# EAGLE design incubator (EAGLE 6.5.0)
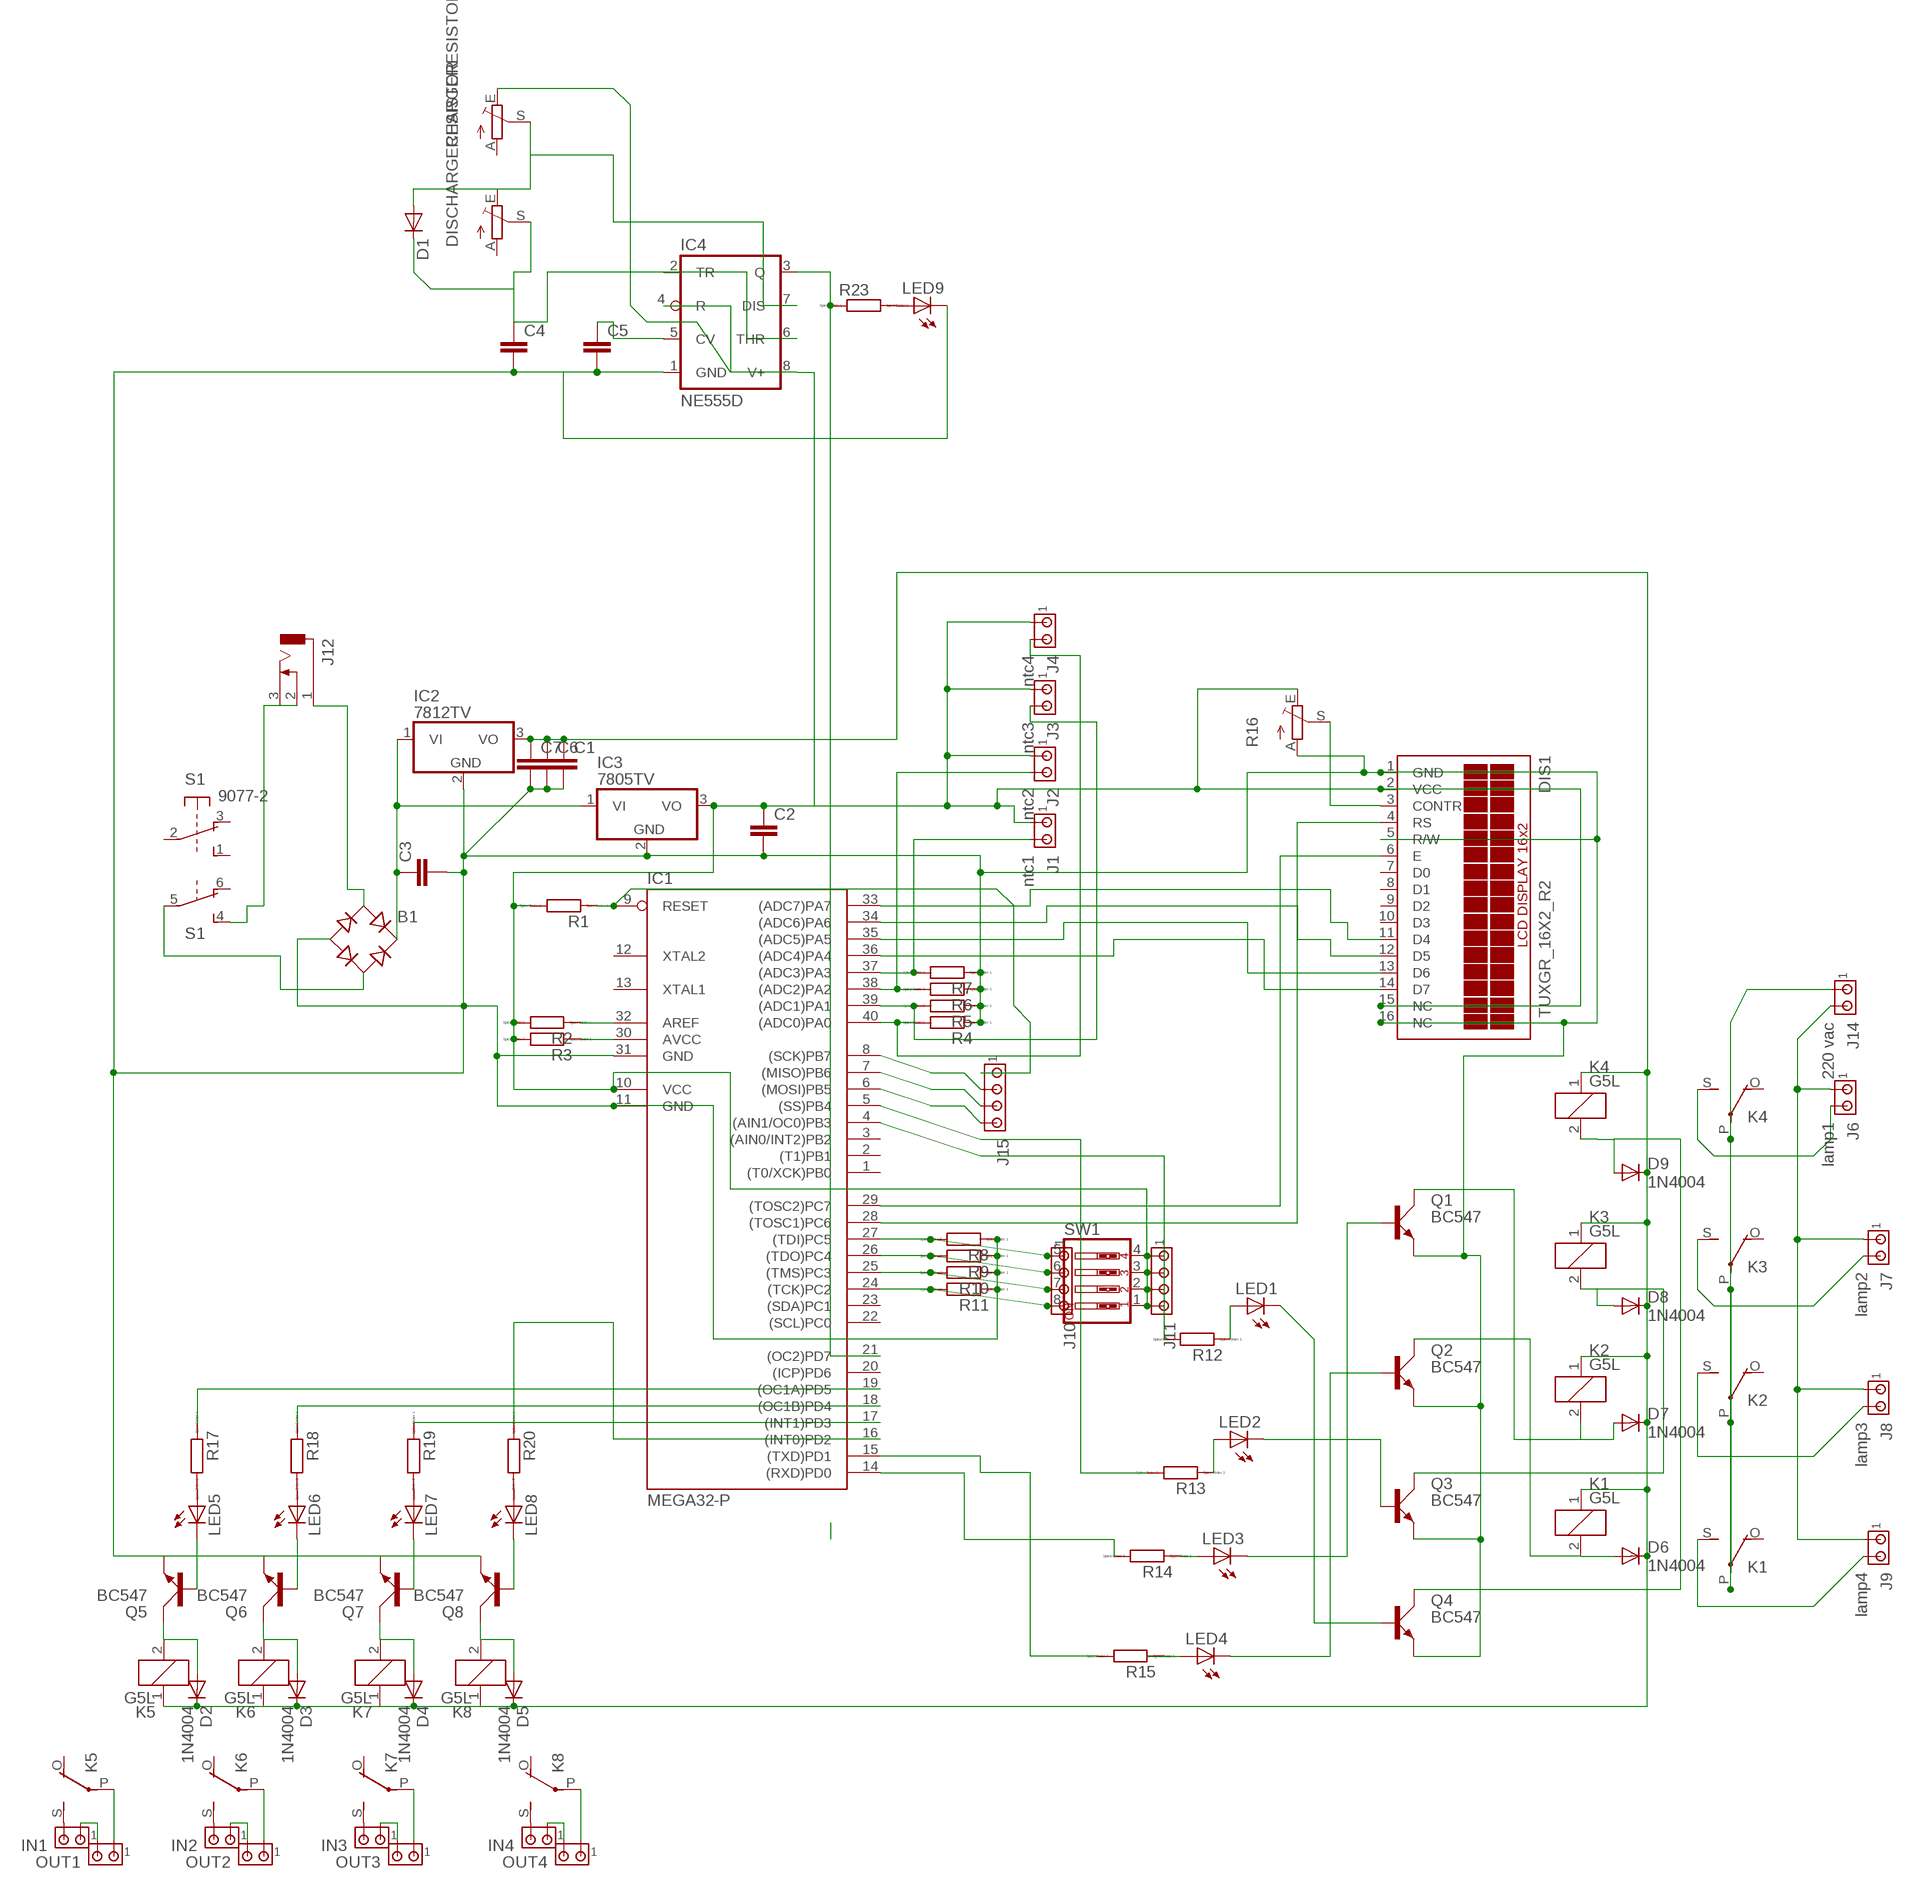
[diagram p0: schematic, sheet 1]

## Parts
B1  RB1A  [RB1A]
C1  C5/2.5  [C5B2.5]
C2  C5/2.5  [C5B2.5]
C3  C5/2.5  [C5B2.5]
C4  C5/2.5  [C5B2.5]
C5  C2,5-3  [C2.5-3]
C6  C5/2.5  [C5B2.5]
C7  C5/2.5  [C5B2.5]
CHARGERESISTOR  TRIM_EU-B64Y  [B64Y]
D1  DIODE-DO-214AC  [DO-214AC]
D2  1N4004  [DO41-10]
D3  1N4004  [DO41-10]
D4  1N4004  [DO41-10]
D5  1N4004  [DO41-10]
D6  1N4004  [DO41-10]
D7  1N4004  [DO41-10]
D8  1N4004  [DO41-10]
D9  1N4004  [DO41-10]
DIS1  TUXGR_16X2_R2  [TUXGR_16X2_R2]
DISCHARGERESISTOR  TRIM_EU-B64Y  [B64Y]
IC1  MEGA32-P  [DIL40]
IC2  7812TV  [TO220V]
IC3  7805TV  [TO220V]
IC4  NE555D  [SO08]
IN1  MTA02-156  [1X2MTA]
IN2  MTA02-156  [1X2MTA]
IN3  MTA02-156  [1X2MTA]
IN4  MTA02-156  [1X2MTA]
J1  ntc1  MTA02-156  [1X2MTA]
J2  ntc2  MTA02-156  [1X2MTA]
J3  ntc3  MTA02-156  [1X2MTA]
J4  ntc4  MTA02-156  [1X2MTA]
J6  lamp1  MTA02-156  [1X2MTA]
J7  lamp2  MTA02-156  [1X2MTA]
J8  lamp3  MTA02-156  [1X2MTA]
J9  lamp4  MTA02-156  [1X2MTA]
J10  MTA04-100  [10X04MTA]
J11  MTA04-100  [10X04MTA]
J12  DCJ0303  [DCJ0303]
J14  220 vac  MTA02-156  [1X2MTA]
J15  MTA04-100  [10X04MTA]
K1  G5L  [G5LE]
K2  G5L  [G5LE]
K3  G5L  [G5LE]
K4  G5L  [G5LE]
K5  G5L  [G5LE]
K6  G5L  [G5LE]
K7  G5L  [G5LE]
K8  G5L  [G5LE]
LED1  LED3MM  [LED3MM]
LED2  LED3MM  [LED3MM]
LED3  LED3MM  [LED3MM]
LED4  LED3MM  [LED3MM]
LED5  LED3MM  [LED3MM]
LED6  LED3MM  [LED3MM]
LED7  LED3MM  [LED3MM]
LED8  LED3MM  [LED3MM]
LED9  LED3MM  [LED3MM]
OUT1  MTA02-156  [1X2MTA]
OUT2  MTA02-156  [1X2MTA]
OUT3  MTA02-156  [1X2MTA]
OUT4  MTA02-156  [1X2MTA]
Q1  BC547  [SOT54A]
Q2  BC547  [SOT54A]
Q3  BC547  [SOT54A]
Q4  BC547  [SOT54A]
Q5  BC547  [SOT54A]
Q6  BC547  [SOT54A]
Q7  BC547  [SOT54A]
Q8  BC547  [SOT54A]
R1  RR1206  [R1206]
R2  RR1206  [R1206]
R3  RR1206  [R1206]
R4  RR1206  [R1206]
R5  RR1206  [R1206]
R6  RR1206  [R1206]
R7  RR1206  [R1206]
R8  RR1206  [R1206]
R9  RR1206  [R1206]
R10  RR1206  [R1206]
R11  RR1206  [R1206]
R12  RR1206  [R1206]
R13  RR1206  [R1206]
R14  RR1206  [R1206]
R15  RR1206  [R1206]
R16  TRIM_EU-B64Y  [B64Y]
R17  RR1206  [R1206]
R18  RR1206  [R1206]
R19  RR1206  [R1206]
R20  RR1206  [R1206]
R23  RR1206  [R1206]
S1  9077-2  [9077-2]
SW1  SW_DIP-4  [EDG-04]

## Nets
5V: C2.1 CHARGERESISTOR.E DIS1.2(VCC) DIS1.15(NC) IC1.10(VCC) IC3.3(VO) IC4.4(R) IC4.8(V+) J1.1 J2.1 J3.1 J4.1 J11.1 J11.2 J11.3 J11.4 R1.2 R2.2 R3.2 R16.E SW1.1 SW1.2 SW1.3 SW1.4
12V: C1.1 C6.1 C7.1 D2.C D3.C D4.C D5.C D6.C D7.C D8.C D9.C IC2.3(VO) K1.1 K2.1 K3.1 K4.1 K5.1 K6.1 K7.1 K8.1
AREF: IC1.32(AREF) R2.1
AVCC: IC1.30(AVCC) R3.1
D4: DIS1.11(D4) IC1.33((ADC7)PA7)
D5: DIS1.12(D5) IC1.34((ADC6)PA6)
D6: DIS1.13(D6) IC1.35((ADC5)PA5)
D7: DIS1.14(D7) IC1.36((ADC4)PA4)
ENABLE: DIS1.6(E) IC1.29((TOSC2)PC7)
GND: B1.- C1.2 C2.2 C3.2 C4.2 C5.2 C6.2 C7.2 DIS1.1(GND) DIS1.5(R/W) DIS1.16(NC) IC1.11(GND) IC1.31(GND) IC2.2(GND) IC3.2(GND) IC4.1(GND) LED9.K(C) Q1.E Q2.E Q3.E Q4.E Q5.E Q6.E Q7.E Q8.E R4.1 R5.1 R6.1 R7.1 R8.1 R9.1 R10.1 R11.1 R16.A
MISO: IC1.7((MISO)PB6) J15.3
MOSI: IC1.6((MOSI)PB5) J15.4
N$2: LED5.A R17.2
N$3: LED6.A R18.2
N$4: LED7.A R19.2
N$5: DIS1.3(CONTR) R16.S
N$6: LED8.A R20.2
N$7: LED5.K(C) Q5.B
N$8: LED6.K(C) Q6.B
N$9: LED7.K(C) Q7.B
N$10: LED8.K(C) Q8.B
N$11: J6.2 K4.S(2:S)
N$12: J7.2 K3.S(2:S)
N$13: J8.2 K2.S(2:S)
N$14: J9.2 K1.S(2:S)
N$15: IN1.2 K5.S(2:S)
N$16: J6.1 J7.1 J8.1 J9.1 J14.2
N$17: J14.1 K1.P(2:P) K2.P(2:P) K3.P(2:P) K4.P(2:P)
N$18: D2.A K5.2 Q5.C
N$19: J12.2 J12.3 S1.4(2:S)
N$20: B1.AC1 J12.1
N$21: B1.AC2 S1.5(2:P)
N$22: IC1.21((OC2)PD7) IC4.3(Q) R23.1
N$23: D3.A K6.2 Q6.C
N$24: D4.A K7.2 Q7.C
N$25: D5.A K8.2 Q8.C
N$26: IN1.1 OUT1.2
N$27: IC1.15((TXD)PD1) R15.2
N$28: IC1.14((RXD)PD0) R14.2
N$29: LED4.K(C) Q2.B
N$30: LED3.K(C) Q1.B
N$31: IC1.5((SS)PB4) R13.2
N$32: IC1.4((AIN1/OC0)PB3) R12.2
N$33: IN2.1 OUT2.2
N$34: IN3.1 OUT3.2
N$35: IN4.1 OUT4.2
N$36: LED1.K(C) Q4.B
N$37: LED2.K(C) Q3.B
N$38: D6.A K1.2 Q2.C
N$39: D7.A K2.2 Q1.C
N$40: D8.A K3.2 Q3.C
N$41: D9.A K4.2 Q4.C
N$42: IN2.2 K6.S(2:S)
N$43: IN3.2 K7.S(2:S)
N$44: IN4.2 K8.S(2:S)
N$45: K5.P(2:P) OUT1.1
N$46: K6.P(2:P) OUT2.1
N$47: K7.P(2:P) OUT3.1
N$48: K8.P(2:P) OUT4.1
N$49: IC1.16((INT0)PD2) R20.1
N$50: IC1.17((INT1)PD3) R19.1
N$51: IC1.18((OC1B)PD4) R18.1
N$52: IC1.19((OC1A)PD5) R17.1
N$53: C5.1 IC4.5(CV)
N$54: C4.1 D1.C DISCHARGERESISTOR.S IC4.2(TR) IC4.6(THR)
N$55: LED9.A R23.2
N$56: LED1.A R12.1
N$57: LED2.A R13.1
N$58: LED4.A R15.1
N$59: LED3.A R14.1
N$60: CHARGERESISTOR.S D1.A DISCHARGERESISTOR.E IC4.7(DIS)
NTC1: IC1.37((ADC3)PA3) J1.2 R7.2
NTC2: IC1.38((ADC2)PA2) J2.2 R6.2
NTC3: IC1.39((ADC1)PA1) J3.2 R5.2
NTC4: IC1.40((ADC0)PA0) J4.2 R4.2
RS: DIS1.4(RS) IC1.28((TOSC1)PC6)
RST: IC1.9(RESET) J15.1 R1.1
SCK: IC1.8((SCK)PB7) J15.2
SW1: IC1.27((TDI)PC5) J10.1 R8.2 SW1.5
SW2: IC1.26((TDO)PC4) J10.2 R9.2 SW1.6
SW3: IC1.25((TMS)PC3) J10.3 R10.2 SW1.7
SW4: IC1.24((TCK)PC2) J10.4 R11.2 SW1.8
VIN: B1.+ C3.1 IC2.1(VI) IC3.1(VI)
Unconnected: CHARGERESISTOR.A DIS1.7(D0) DIS1.8(D1) DIS1.9(D2) DIS1.10(D3) DISCHARGERESISTOR.A IC1.1((T0/XCK)PB0) IC1.2((T1)PB1) IC1.3((AIN0/INT2)PB2) IC1.12(XTAL2) IC1.13(XTAL1) IC1.20((ICP)PD6) IC1.22((SCL)PC0) IC1.23((SDA)PC1) K1.O(2:O) K2.O(2:O) K3.O(2:O) K4.O(2:O) K5.O(2:O) K6.O(2:O) K7.O(2:O) K8.O(2:O) S1.1(1:S) S1.2(1:P) S1.3(1:O) S1.6(2:O)

## Library data of the parts
B1 = rectifier:RB1A: RECTIFIER 1 A
C1-C7 = capacitor-wima:C: CAPACITOR naming: grid - package width
CHARGERESISTOR DISCHARGERESISTOR R16 = pot:TRIM_EU-: POTENTIOMETER
D1 = diode:DIODE-: DIODE
D2-D9 = diode:1N4004: DIODE general purpose rectifier, 1 A
DIS1 = display-lcd:TUXGR_16X2_R2: Tuxgraphics LCD display 16x2 characters reflective, without background light Source: tuxgr_12x2_r2.pdf; OC_FARNELL: unknown; OC_NEWARK: unknown
IC1 = atmel:MEGA32-P: MICROCONTROLLER 32 Kbytes FLASH 2 Kbytes SRAM 1 Kbytes EEPROM USART 8-channel 10 bit ADC Source: www.atmel.com .. doc2503.pdf; MPN: ATMEGA32-16PU; OC_FARNELL: 1661729; OC_NEWARK: 51P1794
IC2 IC3 = linear:78*: Positive VOLTAGE REGULATOR Source: http://cache.national.com/ds/LM/LM78L05.pdf http://www.fairchildsemi.com/ds/LM/LM7805.pdf
IC4 = linear:*555: TIMER
IN1-IN4 J1-J4 J6-J9 J14 OUT1-OUT4 = con-amp:MTA02-156: AMP connector
J10 J11 J15 = con-amp:MTA04-100: AMP connector
J12 = con-jack:DCJ0303: DC POWER JACK Source: DCJ0303.pdf; OC_FARNELL: unknown; OC_NEWARK: unknown
K1-K8 = relay:G5L: RELAY 1 x switch, 10 A/120 V AC, 8 A/30 V ADC, Omron; OC_FARNELL: unknown; OC_NEWARK: unknown
LED1-LED9 = led:LED: LED OSRAM: - CHIPLED LG R971, LG N971, LY N971, LG Q971, LY Q971, LO R971, LY R971 LH N974, LH R974 LS Q976, LO Q976, LY Q976 LO Q996 - Hyper CHIPLED LW Q18S LB Q993, LB Q99A, LB R99A - SideLED LS A670, LO A670, LY A670, LG A670, LP A670 LB A673, LV A673, LT A673, LW A673 LH A674 LY A675 LS A676, LA A676, LO A676, LY A676, LW A676 LS A679, LY A679, LG A679 - Hyper Micro SIDELED® LS Y876, LA Y876, LO Y876, LY Y876 LT Y87S - SmartLED LW L88C, LW L88S LB L89C, LB L89S, LG L890 LS L89K, LO L89K, LY L89K LS L896, LA L896, LO L896, LY L896 - TOPLED LS T670, LO T670, LY T670, LG T670, LP T670 LSG T670, LSP T670, LSY T670, LOP T670, LYG T670 LG T671, LOG T671, LSG T671 LB T673, LV T673, LT T673, LW T673 LH T674 LS T676, LA T676, LO T676, LY T676, LB T676, LH T676, LSB T676, LW T676 LB T67C, LV T67C, LT T67C, LS T67K, LO T67K, LY T67K, LW E67C LS E67B, LA E67B, LO E67B, LY E67B, LB E67C, LV E67C, LT E67C LW T67C LS T679, LY T679, LG T679 LS T770, LO T770, LY T770, LG T770, LP T770 LB T773, LV T773, LT T773, LW T773 LH T774 LS E675, LA E675, LY E675, LS T675 LS T776, LA T776, LO T776, LY T776, LB T776 LHGB T686 LT T68C, LB T68C - Hyper Mini TOPLED® LB M676 - Mini TOPLED Santana® LG M470 LS M47K, LO M47K, LY M47K Source: http://www.osram.convergy.de LUXEON: - LUMILED® LXK2-PW12-R00, LXK2-PW12-S00, LXK2-PW14-U00, LXK2-PW14-V00 LXK2-PM12-R00, LXK2-PM12-S00, LXK2-PM14-U00 LXK2-PE12-Q00, LXK2-PE12-R00, LXK2-PE12-S00, LXK2-PE14-T00, LXK2-PE14-U00 LXK2-PB12-K00, LXK2-PB12-L00, LXK2-PB12-M00, LXK2-PB14-N00, LXK2-PB14-P00, LXK2-PB14-Q00 LXK2-PR12-L00, LXK2-PR12-M00, LXK2-PR14-Q00, LXK2-PR14-R00 LXK2-PD12-Q00, LXK2-PD12-R00, LXK2-PD12-S00 LXK2-PH12-R00, LXK2-PH12-S00 LXK2-PL12-P00, LXK2-PL12-Q00, LXK2-PL12-R00 Source: www.luxeon.com KINGBRIGHT: KA-3528ASYC Source: www.kingbright.com
Q1-Q8 = transistor-small-signal:BC547: NPN TRANSISTOR
R1-R15 R17-R20 R23 = eagle-ltspice:R: RESISTOR, European symbol; SPICEMODEL: NONE; SPICEPREFIX: R
S1 = switch-misc:9077-2: MARQUARDT SWITCH 9077.0200 Distributor: Buerklin <https://www.buerklin.com/default.asp?event=ShowArtikel%2812G2822%29&l=d&jump=ArtNr_12G2822>
SW1 = special:SW_DIP-4: DIP SWITCH

## Board
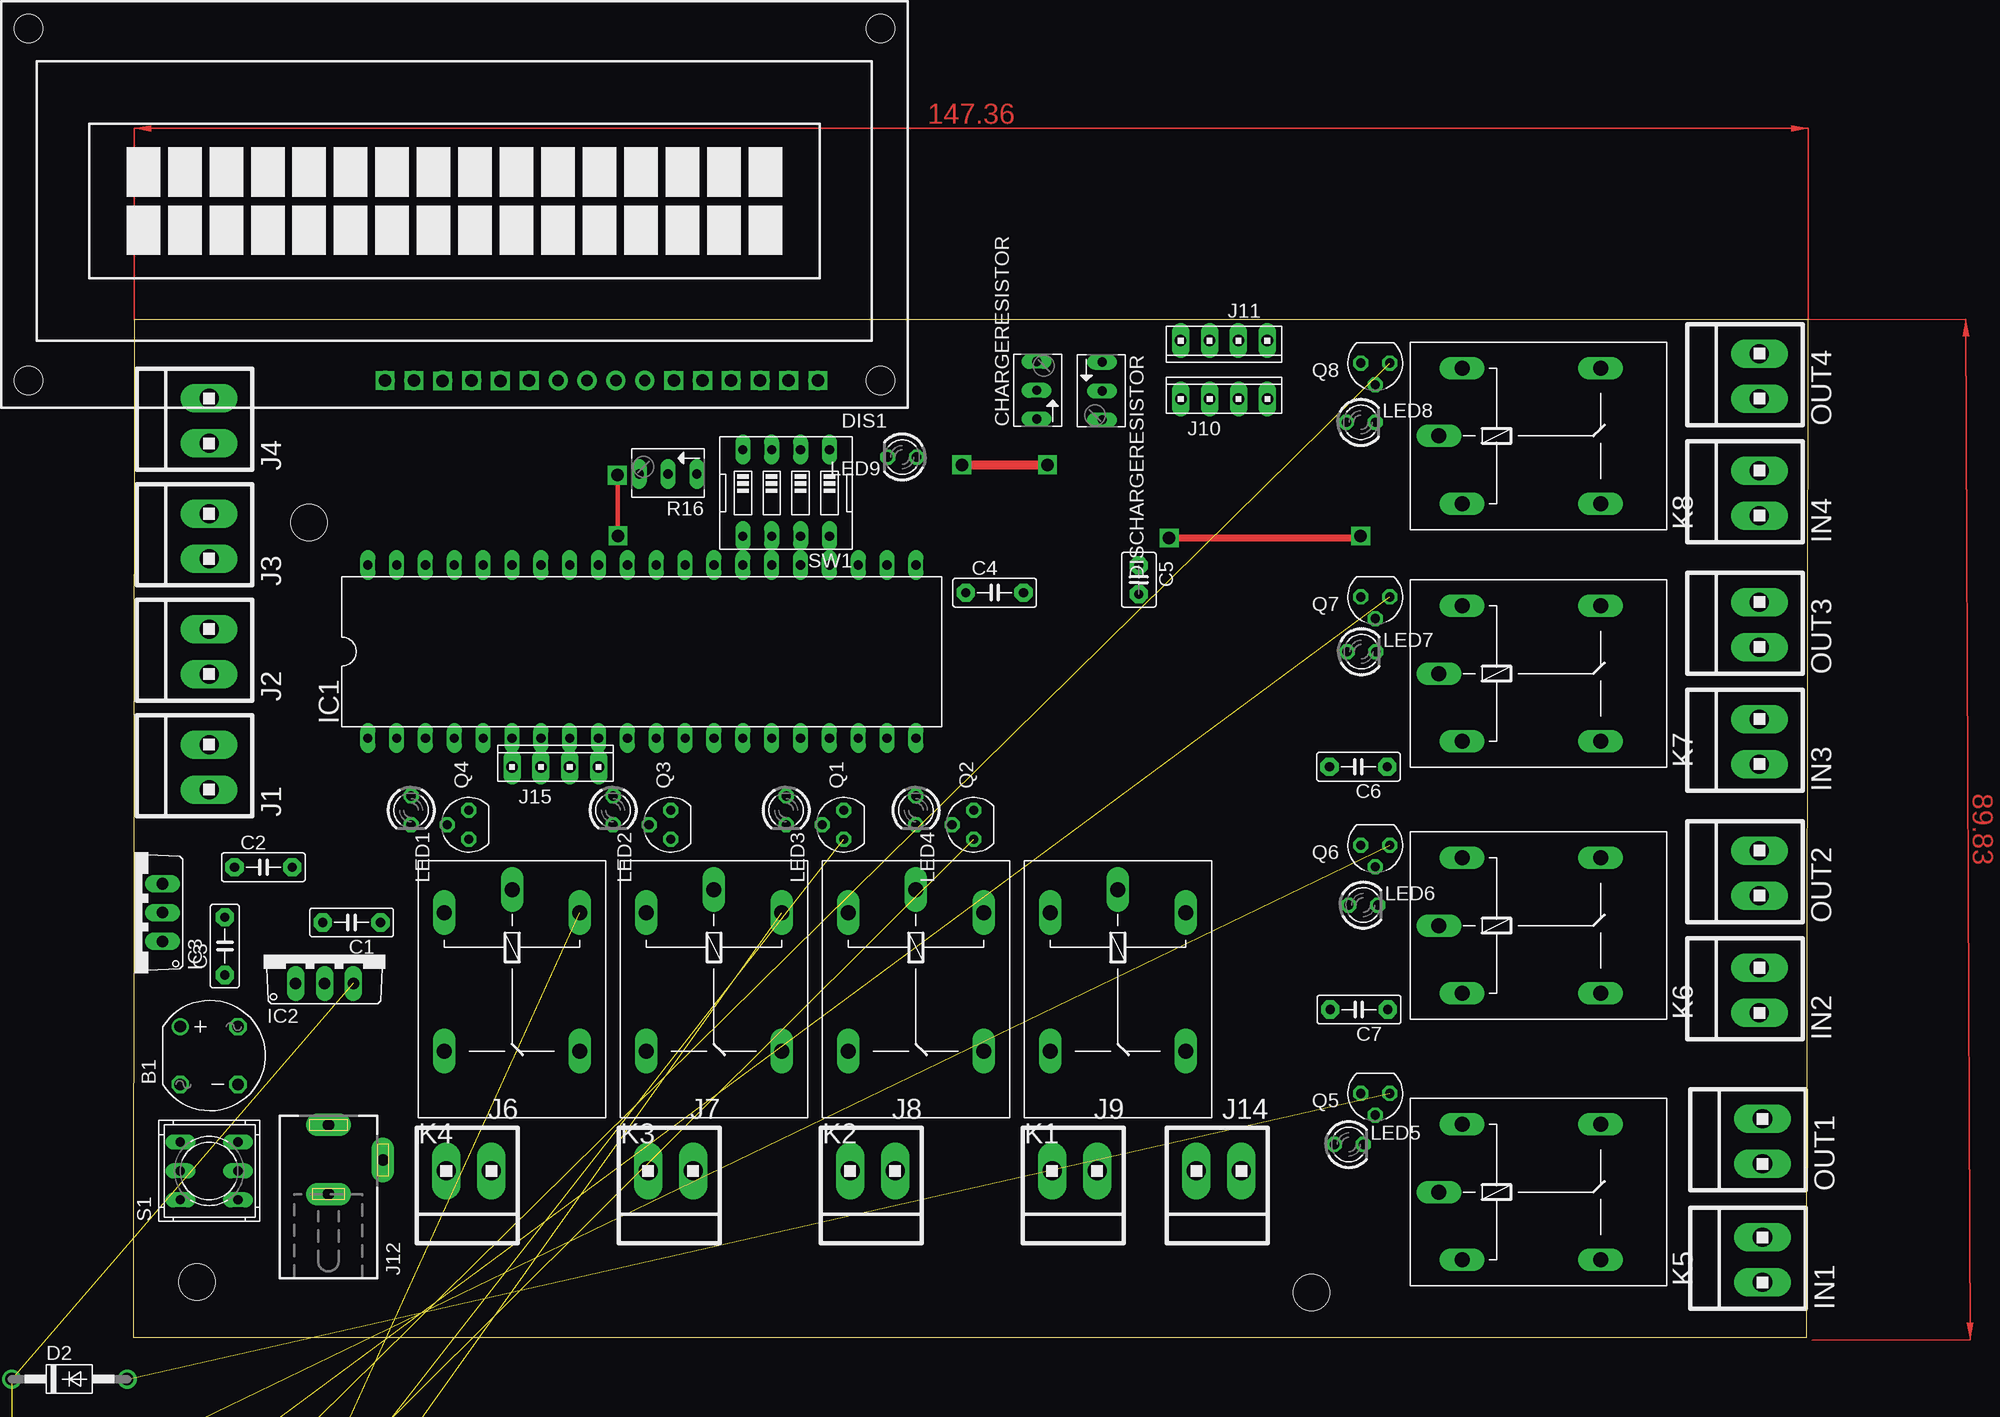
[diagram p1: board, top side]
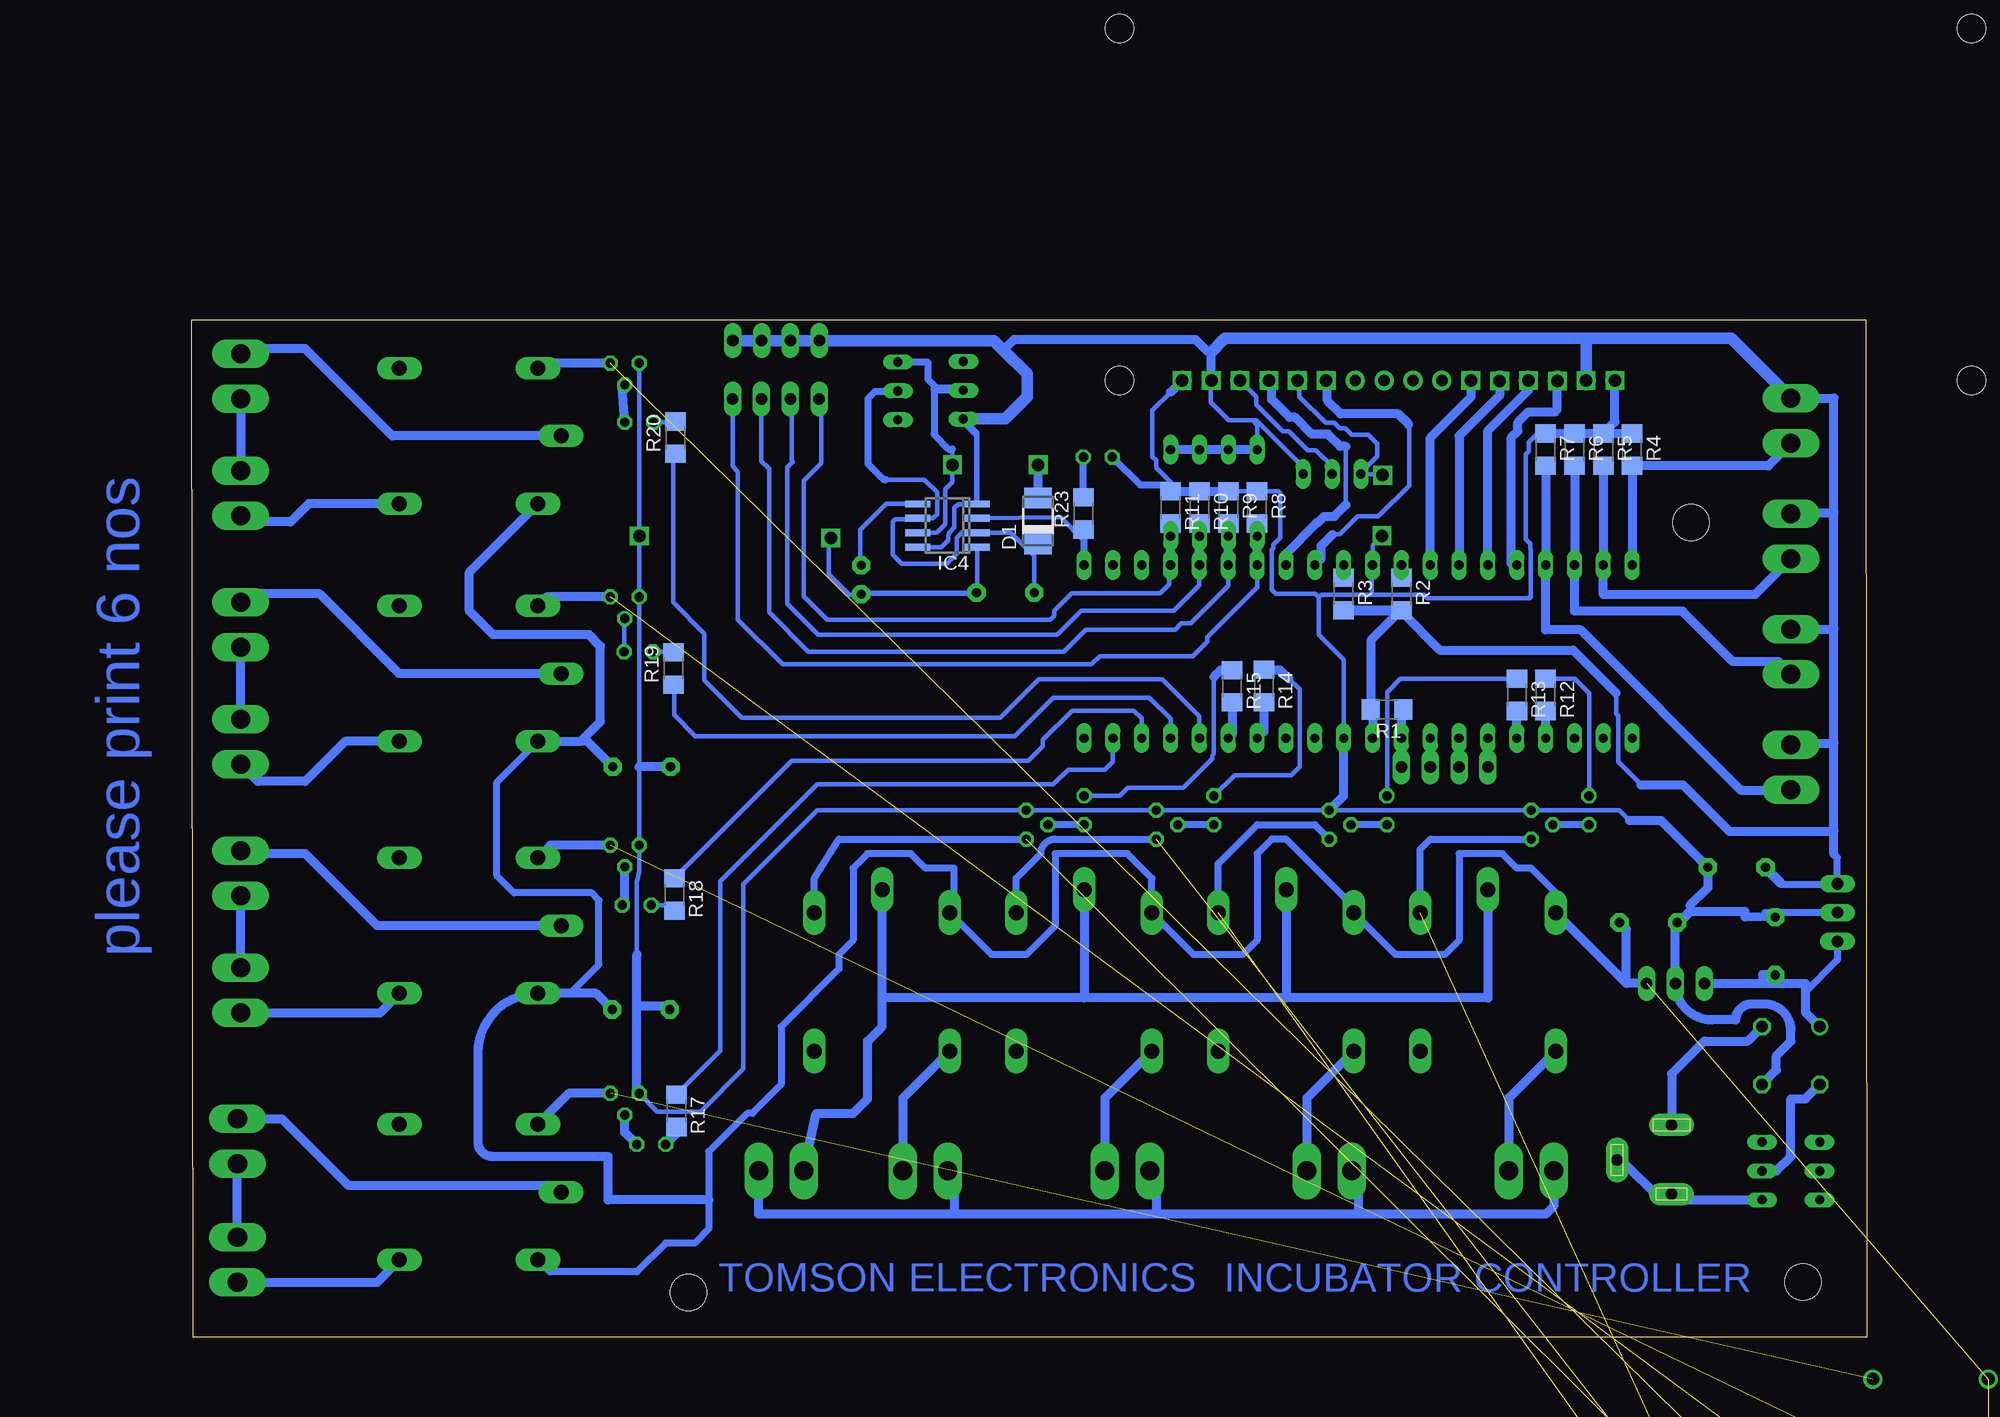
[diagram p2: board, bottom side, seen from below]

Size 147.47 x 89.56 mm. Coordinates in mm from the lower left corner, seen from the top.
Outline: 0,0 147.36,0 147.47,89.56 0.11,89.56 0,0
Copper layers (1*16): Top 0.035mm / dielectric 1.5mm / Bottom 0.035mm
Design rules "default": minimum track width 10mil, minimum drill 24mil, track to track 8mil, track to pad 8mil, pad to pad 8mil, via to via 8mil, smd to smd 8mil, copper to edge 40mil, drill to drill 8mil, minimum pad ring 10mil, minimum via ring 8mil, stop-mask expansion 4mil, vias tented up to drill 0mil, thermal gap 10mil
Holes 3.2 mm at 5.64,4.88 103.76,3.94 15.47,71.75

### Footprints (pad centres in the part's own frame; a part is rotated, then mirrored left to right if it is on the bottom)
RB1A = drill 1.016: + -2.54,2.54 | drill 1.016 octagon: - 2.54,-2.54; AC1 2.54,2.54; AC2 -2.54,-2.54
C5B2.5 = drill 0.813 pad 1.6 octagon: 1 -2.54,0; 2 2.54,0
C2.5-3 = drill 0.813 pad 1.6 octagon: 1 -1.27,0; 2 1.27,0
B64Y = drill 0.813 long: A 2.54,0; E -2.54,0; S 0,0
DO-214AC = smd 1.8 x 2.4: A 2.025,0; C -2.025,0
DO41-10 = drill 1.118: A 5.08,0; C -5.08,0
TUXGR_16X2_R2 = drill 1 pad 1.676: 1 -32,15.5; 2 -29.46,15.5; 3 -26.92,15.5; 4 -24.38,15.5; 5 -21.84,15.5; 6 -19.3,15.5; 7 -16.76,15.5; 8 -14.22,15.5; 9 -11.68,15.5; 10 -9.14,15.5; 11 -6.6,15.5; 12 -4.06,15.5; 13 -1.52,15.5; 14 1.02,15.5; 15 3.56,15.5; 16 6.1,15.5 | hole 2.5: -37.5,-15.5; 37.5,-15.5; -37.5,15.5; 37.5,15.5
DIL40 = drill 0.813 long: 1 -24.13,-7.62; 2 -21.59,-7.62; 3 -19.05,-7.62; 4 -16.51,-7.62; 5 -13.97,-7.62; 6 -11.43,-7.62; 7 -8.89,-7.62; 8 -6.35,-7.62; 9 -3.81,-7.62; 10 -1.27,-7.62; 11 1.27,-7.62; 12 3.81,-7.62; 13 6.35,-7.62; 14 8.89,-7.62; 15 11.43,-7.62; 16 13.97,-7.62; 17 16.51,-7.62; 18 19.05,-7.62; 19 21.59,-7.62; 20 24.13,-7.62; 21 24.13,7.62; 22 21.59,7.62; 23 19.05,7.62; 24 16.51,7.62; 25 13.97,7.62; 26 11.43,7.62; 27 8.89,7.62; 28 6.35,7.62; 29 3.81,7.62; 30 1.27,7.62; 31 -1.27,7.62; 32 -3.81,7.62; 33 -6.35,7.62; 34 -8.89,7.62; 35 -11.43,7.62; 36 -13.97,7.62; 37 -16.51,7.62; 38 -19.05,7.62; 39 -21.59,7.62; 40 -24.13,7.62
TO220V = drill 1.016 long: 1 -2.54,-2.54; 2 0,-2.54; 3 2.54,-2.54
SO08 = smd 0.6 x 2.2: 1 -1.905,-2.6; 2 -0.635,-2.6; 3 0.635,-2.6; 4 1.905,-2.6; 5 1.905,2.6; 6 0.635,2.6; 7 -0.635,2.6; 8 -1.905,2.6
1X2MTA = drill 1.676 long: 1 1.981,0; 2 -1.981,0
10X04MTA = drill 1.016 long: 1 3.81,0; 2 1.27,0; 3 -1.27,0; 4 -3.81,0
DCJ0303 = drill 1 pad 2 long: 1 0,3.1; 2 4.8,0; 3 0,-3
G5LE = drill 1.321 long: 1 -7.493,-5.969; 2 -7.493,5.969; O 4.699,5.969; P -9.525,0; S 4.699,-5.969
LED3MM = drill 0.813 octagon: A -1.27,0; K 1.27,0
SOT54A = drill 0.813 octagon: B 0,1.905; C -1.27,0; E 1.27,0
R1206 = smd 1.6 x 1.803: 1 -1.422,0; 2 1.422,0
9077-2 = drill 0.813 long: 1 -2.54,2.54; 2 0,2.54; 3 2.54,2.54; 4 -2.54,-2.54; 5 0,-2.54; 6 2.54,-2.54
EDG-04 = drill 0.813 long: 1 -3.81,-3.81; 2 -1.27,-3.81; 3 1.27,-3.81; 4 3.81,-3.81; 5 3.81,3.81; 6 1.27,3.81; 7 -1.27,3.81; 8 -3.81,3.81

### Placement (x,y rotation side)
B1  6.69,24.8 0 top
C1  19.24,36.52 180 top
C2  11.47,41.38 0 top
C3  8.07,34.44 90 top
C4  75.85,65.55 0 top
C5  88.54,66.69 270 top
C6  107.87,50.23 180 top
C7  107.92,28.85 180 top
CHARGERESISTOR  79.55,83.38 90 top
D1  72.97,71.87 90 bottom
D2  -5.61,-3.67 0 top  (outside the outline)
D3  -5.61,-10.32 0 top  (outside the outline)
D4  -5.61,-16.97 0 top  (outside the outline)
D5  -5.61,-23.61 0 top  (outside the outline)
D6  -5.61,-30.26 0 top  (outside the outline)
D7  -5.61,-36.91 0 top  (outside the outline)
D8  -5.61,-43.55 0 top  (outside the outline)
D9  -5.61,-50.2 0 top  (outside the outline)
DIS1  28.28,99.73 180 top
DISCHARGERESISTOR  85.32,83.32 270 top
IC1  44.79,60.36 0 top
IC2  16.85,33.69 0 top
IC3  0.05,37.39 90 top
IC4  80.94,71.47 90 bottom
IN1  143.45,6.82 90 top
IN2  143.17,30.55 90 top
IN3  143.17,52.44 90 top
IN4  143.17,74.32 90 top
J1  6.69,50.2 90 top
J2  6.69,60.36 90 top
J3  6.69,70.52 90 top
J4  6.69,80.68 90 top
J6  29.55,14.64 180 top
J7  47.33,14.64 180 top
J8  65.11,14.64 180 top
J9  82.89,14.64 180 top
J10  96.05,82.62 0 top
J11  96.04,87.75 180 top
J12  17.19,15.6 0 top
J14  95.59,14.64 180 top
J15  37.17,50.2 0 top
K1  86.7,29.88 270 top
K2  68.92,29.88 270 top
K3  51.14,29.88 270 top
K4  33.36,29.88 270 top
K5  124.49,12.78 0 top
K6  124.49,36.25 0 top
K7  124.49,58.44 0 top
K8  124.49,79.36 0 top
LED1  24.47,46.39 270 top
LED2  42.25,46.39 270 top
LED3  57.49,46.39 270 top
LED4  68.92,46.39 270 top
LED5  107.03,16.98 0 top
LED6  108.3,38.06 0 top
LED7  108.14,60.36 0 top
LED8  108.08,80.56 0 top
LED9  67.71,77.49 180 top
OUT1  143.45,17.25 90 top
OUT2  143.17,40.86 90 top
OUT3  143.17,62.74 90 top
OUT4  143.17,84.63 90 top
Q1  62.57,45.12 90 top
Q2  74,45.12 90 top
Q3  47.33,45.12 90 top
Q4  29.55,45.12 90 top
Q5  109.36,21.47 180 top
Q6  109.36,43.33 180 top
Q7  109.36,65.18 180 top
Q8  109.36,85.77 180 top
R1  42.25,55.28 180 bottom
R2  40.98,65.44 270 bottom
R3  46.06,65.44 270 bottom
R4  20.66,78.14 270 bottom
R5  23.2,78.14 270 bottom
R6  25.74,78.14 270 bottom
R7  28.28,78.14 270 bottom
R8  53.68,73.06 270 bottom
R9  56.22,73.06 270 bottom
R10  58.76,73.06 270 bottom
R11  61.3,73.06 270 bottom
R12  28.28,56.55 270 bottom
R13  30.82,56.55 270 bottom
R14  53.08,57.33 270 bottom
R15  55.87,57.32 270 bottom
R16  47.09,76 180 top
R17  104.82,19.93 270 bottom
R18  104.99,38.98 270 bottom
R19  105.07,58.89 90 bottom
R20  104.9,79.21 90 bottom
R23  68.99,72.54 90 bottom
S1  6.69,14.64 90 top
SW1  57.49,74.33 180 top

### Tracks (layer width: path | path; a pad name or v marks a point on that pad's centre or on a via)
5V
  Bottom 0.406: 22.07,56.71 22.07,54.91 21.89,54.73 21.89,50.65 19.88,48.64 | R16.E 49.63,76.59 53.75,80.72 54.09,80.72 | 54.09,80.72 56.17,80.72 57.77,82.33 57.77,84.2 DIS1.2 | SW1.4 53.68,80.31 54.09,80.72 | 58.07,86.81 57.74,86.48 | IC4.4 78.34,79.63 CHARGERESISTOR.E | IC4.8 81.48,69.56 80.88,70.16 80.88,70.63 80.85,70.66 80.85,70.78 80.33,71.3 80.33,73.03 80.01,73.36 78.35,73.36 IC4.4 | 78.45,73.27 IC4.4 | IC4.4 78.4,73.43 78.4,79.38 79.46,80.44 79.46,80.72 79.35,80.83 76.01,80.83 74.06,82.77 74.06,82.94
  Bottom 0.61: 2.91,42.55 2.59,42.23 IC3.3 2.63,39.89 7.66,39.89 8.93,41.16 C2.1
  Bottom 0.813: 2.91,42.55 2.91,44.64 | 2.91,44.64 2.91,52.3 | 2.91,52.3 2.91,62.35 | 2.91,62.35 2.91,72.6 | 2.91,72.6 2.91,82.68 6.68,82.68 J4.1 | J3.1 6.6,72.6 2.91,72.6 | J2.1 2.91,62.35 | J1.1 6.57,52.3 2.91,52.3 | IC1.10 43.52,55.13 R1.2 43.62,55.34 43.62,61.43 41.03,64.02 R2.2 R3.2 45.98,63.95 41.05,63.95 37.6,60.5 25.86,60.5 22.07,56.71 | DIS1.2 57.74,86.48 57.74,86.74 | 19.88,48.64 16.21,48.64 12.11,44.54 3,44.54 2.91,44.64 | 7.59,40.04 C2.1 | SW1.4 SW1.3 SW1.2 SW1.1 | 58.07,86.81 59.11,87.84 75.09,87.84 76.03,86.9
  Bottom 1.016: J4.1 6.69,82.7 11.94,87.95 24.95,87.95 | 24.95,87.95 56.53,87.95 57.74,86.74 | DIS1.15 24.72,87.72 24.95,87.95 | J11.4 J11.3 J11.2 J11.1 76.87,87.75 76.03,86.9 73.93,84.81 73.93,82.81 75.86,80.88 79.51,80.88 CHARGERESISTOR.E
12V  (8 unrouted)
  Bottom 0.61: K4.1 27.39,39.16 29.55,41.31 30.82,41.31 32.09,42.58 35.9,42.58 35.9,34.96 37.17,33.69 41.49,33.69 K3.1 45.17,37.89 51.14,43.85 52.41,43.85 53.68,42.58 53.68,34.96 54.95,33.69 59.27,33.69 K2.1 62.95,40.43 65.11,42.58 71.46,42.58 71.46,36.23 74,33.69 77.05,33.69 K1.1 80.35,37.38 80.35,41.31 82.89,41.31 84.16,42.58 87.97,42.58 89.24,41.31 89.24,34.96 90.51,33.69 90.51,32.42 95.59,27.34 95.59,22.26 98.13,19.72 98.59,19.72 101.96,16.35 101.96,12.13 101.94,12.1 101.94,9.56 103.21,8.29 105.75,8.29 108.29,5.75 115.94,5.75 K5.1 | K6.1 114.15,30.28 111.63,32.8 111.63,38.49 112.28,39.14 119.12,39.14 120.62,40.64 120.62,48.85 K7.1
  Bottom 0.813: IC2.3 21.17,31.15 | 21.17,31.15 K4.1 | 21.17,31.15 21.17,35.91 C1.1 | 101.94,12.1 110.83,12.1 110.83,15.91 120.99,15.91 arc90 122.26,17.18 122.26,25.01 arc90 K6.1 111.89,30.28 C7.1 | K7.1 113.23,52.47 | 113.23,52.47 111.49,54.21 111.49,60.86 112.5,61.86 120.94,61.86 123.03,63.95 123.03,67.35 K8.1 | C6.1 112.65,52.47 113.23,52.47
AREF
  Bottom 0.254: IC1.32 R2.1 40.98,66.71
AVCC
  Bottom 0.254: IC1.30 R3.1 46.06,66.71
D4
  Bottom 0.813: IC1.33 38.44,79.21 34.84,82.8 34.84,84.2 DIS1.11
D5
  Bottom 0.813: DIS1.12 32.34,82.92 35.89,79.37 IC1.34
D6
  Bottom 0.813: IC1.35 33.36,79.82 29.8,83.38 DIS1.13
D7
  Bottom 0.813: IC1.36 30.74,68.07 31.3,68.07 31.3,79.22 30.74,79.78 30.74,80.54 29.79,81.48 27.46,81.48 27.26,81.68 DIS1.14
ENABLE
  Bottom 0.406: 47.03,70.69 46.41,70.69 44.83,72.27 43.01,72.27 40.31,74.98 40.31,80.34 40.35,80.38
  Bottom 0.813: IC1.29 48.04,68.54 48.04,69.68 47.03,70.69 | 40.35,80.38 41.28,81.31 46.33,81.31 47.49,82.47 47.49,84.14 DIS1.6
GND  (via drill 0.6)
  Top 0.406: v42.66,75.9 42.66,70.57 v42.7,70.54 | 107.89,70.39 v108.09,70.59
  Top 0.61: v91.25,70.39 107.89,70.39
  Bottom 0.254: 15.58,38.02 15.58,37.5
  Bottom 0.406: 20.91,45.5 21.8,46.39 Q4.E Q3.E Q1.E Q2.E 92.39,46.39 98.91,39.88 98.91,23.62 102.66,19.88 106.5,19.88 Q5.E | DIS1.5 49.95,84.07 49.95,82.82 47.63,80.49 46.89,80.49 46.42,80.02 45.93,80.02 45.36,79.46 43.9,79.46 43.09,78.65 43.09,77.56 44.55,76.1 R16.A 42.76,76 v42.66,75.9 | v42.7,70.54 43.52,69.72 IC1.31 43.61,67.9 43.61,65.39 | R11.1 61.3,75.04 61.3,75.26 62.58,76.54 62.58,77.19 62.91,77.52 62.91,81.61 61.3,83.21 | 108.29,33.69 108.29,40.04 108.09,41.02 108.09,41.97 Q6.E 108.09,50.22 Q7.E v108.09,70.59 Q8.E | R9.1 R8.1 51.83,74.49 51.63,74.29 51.63,70.41 52.26,69.79 52.26,69.46 52.38,69.34 52.38,65.82 52.02,65.46 48.58,65.46 48.26,65.13 | IC1.11 46.06,59.66 48.26,61.86 48.26,65.13 | 48.26,65.13 48.01,65.39 43.61,65.39 | R7.1 29,79.57 29.77,78.79 29.77,77.99 30.01,77.74 30.01,70.26 29.64,69.88 29.64,69.42 29.58,69.37 29.58,65.16 29.69,65.06 38.68,65.06 38.99,65.36 39.63,65.36 39.7,65.44 39.75,65.39 43.61,65.39 | C5.2 88.41,65.55 C4.2 78.34,65.6 IC4.1 78.34,65.6 78.5,65.45 88.58,65.45 88.65,65.38 89.58,65.38 91.38,67.18 91.38,70.25 v91.25,70.39
  Bottom 0.61: IC3.2 8.98,37.39 C3.2 | LED9.K 63.99,75.04 61.3,75.04
  Bottom 0.813: 15.49,37.5 15.58,37.5 16.85,36.23 IC2.2 arc-90 13.63,27.94 11.56,27.94 arc90 10.17,29.33 8.97,29.33 arc90 6.69,27.05 6.69,26.07 7.96,24.8 7.96,23.53 B1.- | 15.49,37.5 10.72,37.5 10.72,37.02 C3.2 | Q3.E 46.06,47.66 IC1.11 | 61.3,83.21 DIS1.1 | R4.1 R5.1 | R5.1 R6.1 R7.1 | R5.1 22.18,80.59 DIS1.16 | R11.1 R10.1 R9.1 | 15.58,38.02 14.01,39.59 C2.2 18.13,45.5 20.91,45.5 | C1.2 16.47,36.52 15.49,37.5 | Q5.E 108.29,21.67 108.29,29.15 | 108.29,29.15 108.29,33.69 | C7.2 105.68,29.15 108.29,29.15 | C6.2 108.09,50.22
MISO
  Bottom 0.813: J15.3 IC1.7
MOSI
  Bottom 0.813: J15.4 IC1.6
N$2
  Bottom 0.813: LED5.A 104.82,17.92 R17.2
N$3
  Bottom 0.406: LED6.A 105.48,38.06 R18.2
N$4
  Bottom 0.406: LED7.A 105.13,60.36 R19.2
N$5
  Bottom 0.406: R16.S 47.09,76.67 48.52,78.1 49.24,78.1 50.89,79.76 51.43,79.76 53.75,82.08 53.75,82.79 DIS1.3
N$6
  Bottom 0.406: LED8.A 104.98,80.56 R20.2
N$7
  Bottom 0.813: LED5.K 109.36,18.04 Q5.B
N$8
  Bottom 0.813: LED6.K 109.36,38.27 Q6.B
N$9
  Bottom 0.406: LED7.K 109.41,63.23 Q7.B
N$10
  Bottom 0.813: LED8.K 109.57,83.66 Q8.B
N$11
  Bottom 0.813: K4.S 31.53,21.05 J6.2
N$12
  Bottom 0.813: K3.S 49.31,21.05 J7.2
N$13
  Bottom 0.813: K2.S 67.09,21.05 J8.2
N$14
  Bottom 0.813: K1.S 84.87,21.05 J9.2
N$15
  Bottom 0.813: IN1.2 131.17,4.84 K5.S
N$16
  Bottom 0.813: J6.1 27.57,11.55 28.28,10.83 44.79,10.83 | 44.79,10.83 62.57,10.83 | 62.57,10.83 80.35,10.83 | 80.35,10.83 97.57,10.83 J14.2 | J9.1 80.35,14.09 80.35,10.83 | J8.1 62.57,14.09 62.57,10.83 | J7.1 44.79,14.09 44.79,10.83
N$17
  Bottom 0.813: J14.1 92.49,19.72 89.24,19.72 87.97,20.99 87.97,26.07 86.7,27.34 86.7,29.88 | 86.7,29.88 K1.P | K4.P 33.36,29.88 51.14,29.88 | 51.14,29.88 68.92,29.88 | 68.92,29.88 86.7,29.88 | K3.P 51.14,29.88 | K2.P 68.92,29.88
N$18  (1 unrouted)
  Bottom 0.813: Q5.C 114.28,21.47 K5.2
N$19
  Bottom 0.813: 17.15,12.1 18.12,12.1 21.62,15.6 J12.2 | 17.15,12.1 S1.4 | J12.3 17.15,12.56 17.15,12.1
N$20
  Bottom 0.813: B1.AC1 10.5,26.07 14.31,26.07 17.19,23.19 J12.1
N$21
  Bottom 0.813: S1.5 7.96,14.64 6.69,15.91 6.69,20.99 5.42,20.99 B1.AC2
N$22
  Bottom 0.406: IC4.3 70.97,72.18 68.93,70.14 68.93,68.65 IC1.21
  Bottom 0.61: R23.1 68.93,71.06 68.93,68.65
N$23  (1 unrouted)
  Bottom 0.813: Q6.C 115.88,43.33 K6.2
N$24  (1 unrouted)
  Bottom 0.813: Q7.C 116.22,65.18 K7.2
N$25  (1 unrouted)
  Bottom 0.813: Q8.C 116.55,85.77 K8.2
N$26
  Bottom 0.813: IN1.1 OUT1.2
N$27
  Bottom 0.813: R15.2 55.87,53.09 IC1.15
N$28
  Bottom 0.813: R14.2 53.08,53.34 IC1.14
N$29
  Bottom 0.61: LED4.K Q2.B
N$30
  Bottom 0.61: LED3.K Q1.B
N$31
  Bottom 0.813: IC1.5 R13.2
N$32
  Bottom 0.813: IC1.4 R12.2
N$33
  Bottom 0.813: IN2.1 OUT2.2
N$34
  Bottom 0.813: IN3.1 OUT3.2
N$35
  Bottom 0.813: OUT4.2 IN4.1
N$36
  Bottom 0.61: LED1.K Q4.B
N$37
  Bottom 0.61: LED2.K Q3.B
N$38  (1 unrouted)
  Bottom 0.61: K1.2 92.67,40.43 90.51,43.85 Q2.C
N$39  (1 unrouted)
  Bottom 0.61: K2.2 74.89,40.43 72.73,42.58 arc90 71.46,43.85 Q1.C
N$40  (1 unrouted)
  Bottom 0.61: K3.2 57.11,41.7 53.68,45.12 48.6,45.12 Q3.C
N$41  (1 unrouted)
  Bottom 0.61: K4.2 39.33,42.97 38.44,43.85 Q4.C
N$42
  Bottom 0.813: IN2.2 130.9,28.57 K6.S
N$43
  Bottom 0.813: K7.S 133.97,52.47 137.5,48.93 141.65,48.93 IN3.2
N$44
  Bottom 0.813: K8.S 137.18,73.39 138.77,71.79 142.58,71.79 143.85,73.06 143.85,73.02 IN4.2
N$45
  Bottom 0.813: OUT1.1 139.55,19.23 133.69,13.37 115.56,13.37 K5.P
N$46
  Bottom 0.813: K6.P 131.16,36.25 137.5,42.58 142.91,42.58 OUT2.1
N$47
  Bottom 0.813: K7.P 129.22,58.44 136.23,65.44 142.45,65.44 OUT3.1
N$48
  Bottom 0.813: K8.P 129.82,79.36 137.5,87.03 143.6,87.03 | 143.85,87.03 143.6,87.03 | 143.6,87.03 OUT4.1
N$49
  Bottom 0.406: IC1.16 58.76,54.66 62.04,57.93 72.9,57.93 76.28,54.55 99.05,54.55 102.35,57.85 102.35,61.96 105.08,64.69 105.08,77.61 R20.1
N$50
  Bottom 0.406: IC1.17 61.3,54.46 63.16,56.32 71.62,56.32 75.02,52.92 103.13,52.92 105,54.79 105,57.39 R19.1
N$51
  Bottom 0.406: IC1.18 63.84,54.49 64.53,55.18 69.98,55.18 72.54,52.62 72.54,52.05 73.85,50.74 94.65,50.74 R18.1
N$52
  Bottom 0.406: IC1.19 66.38,50.67 67.09,49.96 70.33,49.96 71.61,48.67 92.39,48.67 100.94,40.13 100.94,25.23 R17.1
N$53
  Bottom 0.406: IC4.5 86.35,73.37 88.61,71.11 88.61,68.03 C5.1
N$54
  Bottom 0.406: 73.88,69.36 75.36,70.83 IC4.2 79.68,70.83 80.11,70.4 80.11,68.98 80.99,68.09 84.96,68.09 85.76,68.9 85.76,71.82 85.55,72.03 83.61,72.03 IC4.6 82.23,72.1 81.86,72.48 81.86,74.39 82.97,75.5 86.36,75.5 | 73.88,69.36 73.32,68.8 73.32,65.57 C4.1 | D1.C 73.45,69.36 73.88,69.36
  Bottom 0.61: DISCHARGERESISTOR.S 85.38,83.26 87.34,83.26 87.95,82.65 87.95,76.89 86.57,75.5 86.36,75.5
N$55
  Bottom 0.61: R23.2 68.98,73.97 LED9.A
N$56
  Bottom 0.406: LED1.A 24.45,47.68 24.45,56.72 25.71,57.98 R12.1
N$57
  Bottom 0.406: R13.1 41.07,57.98 42.24,56.8 LED2.A
N$58
  Bottom 0.406: LED4.A 65.79,47.66 65.05,48.4 60.17,48.4 57.65,50.93 57.65,51.21 57.48,51.38 57.48,58.14
  Bottom 0.813: R15.1 56.89,58.74 57.48,58.14
N$59
  Bottom 0.406: 50.89,57.98 49.94,57.03 49.94,50.21 50.68,49.48 55.67,49.48 LED3.A
  Bottom 0.813: R14.1 51.67,58.76 50.89,57.98
N$60  (via drill 0.6, 1.1)
  Top 0.813: v72.96,76.77 73.01,76.81 v80.51,76.81 v80.52,76.81
  Bottom 0.406: IC4.7 81.9,70.83 81.15,71.58 81.15,74.66 80.52,75.29 v80.52,76.81 | 80.52,76.86 80.52,78.19 | 79.59,83.34 CHARGERESISTOR.S
  Bottom 0.61: 81.81,83.48 82.64,84.32 82.64,85.8 82.7,85.86 DISCHARGERESISTOR.E | 79.59,83.34 79.77,83.51 82.1,83.51 82.13,83.48 82.13,79.46 80.86,78.19 80.52,78.19
  Bottom 0.813: D1.A v72.96,76.77 | v80.52,76.81 80.52,76.86 | 79.59,83.34 79.74,83.48 81.81,83.48
N$61  (via drill 1.1)
  other vias: 91.21,70.37
N$62  (via drill 1.1)
  other vias: 108.08,70.56
N$63  (via drill 1.1)
  other vias: 72.96,76.81
N$64  (via drill 1.1)
  other vias: 42.63,75.89
N$65  (via drill 1.1)
  other vias: 42.68,70.56
N$66  (via drill 1.1)
  other vias: 22.18,84.22
N$67  (via drill 1.1)
  other vias: 24.73,84.22
N$68  (via drill 1.1)
  other vias: 27.23,84.2
N$69  (via drill 1.1)
  other vias: 29.8,84.22
N$70  (via drill 1.1)
  other vias: 32.32,84.2
N$71  (via drill 1.1)
  other vias: 34.87,84.22
N$72  (via drill 1.1)
  other vias: 47.6,84.22
N$73  (via drill 1.1)
  other vias: 50.15,84.22
N$74  (via drill 1.1)
  other vias: 52.63,84.22
N$75  (via drill 1.1)
  other vias: 55.2,84.22
N$76  (via drill 1.1)
  other vias: 57.72,84.22
N$77  (via drill 1.1)
  other vias: 60.29,84.22
NTC1
  Bottom 0.813: J1.2 6.77,48.14 11.05,48.14 25.2,62.29 28.28,62.29 IC1.37 R7.2
NTC2
  Bottom 0.813: J2.2 7.79,59.48 11.8,59.48 16.24,63.92 25.73,63.92 25.74,63.93 IC1.38 R6.2
NTC3
  Bottom 0.813: J3.2 9.85,65.38 23.2,65.38 | 23.2,65.38 | 23.2,65.38 IC1.39 R5.2
NTC4
  Bottom 0.813: J4.2 8.67,76.72 R4.2 IC1.40
RS
  Bottom 0.406: 45.87,73.29 45.87,78.43
  Bottom 0.813: IC1.28 51.14,68.99 48.42,71.71 48.32,71.71 47.77,72.27 46.89,72.27 45.87,73.29 | 45.87,78.43 46.38,78.43 47.45,79.51 48.86,79.51 50.33,80.99 50.83,80.99 52.41,82.57 52.41,83.99 DIS1.4
RST
  Bottom 0.813: J15.1 IC1.9 40.98,55.13 R1.1
SCK
  Bottom 0.813: J15.2 IC1.8
SW1
  Bottom 0.254: SW1.5 R8.2 53.68,71.79
  Bottom 0.406: 53.68,71.79 53.68,66.04 58.08,61.64 58.08,61.24 59.34,59.97 67.55,59.97 68.29,59.24 95.45,59.24 99.39,63.18 99.39,76.2 99.86,76.67 J10.1
  Bottom 0.813: IC1.27 SW1.5
SW2
  Bottom 0.254: SW1.6 R9.2 56.22,71.79
  Bottom 0.406: 56.22,71.79 56.22,66.17 59.54,62.84 60.35,62.84 60.88,62.31 68.75,62.31 70.69,60.37 93.18,60.37 96.66,63.84 96.66,76.46 97.32,77.13 J10.2
  Bottom 0.813: IC1.26 SW1.6
SW3
  Bottom 0.254: SW1.7 R10.2 58.76,71.79
  Bottom 0.406: 58.76,71.79 58.76,66.23 61.01,63.98 69.16,63.98 71.29,61.84 92.32,61.84 95.05,64.58 95.05,76.6 94.59,77.06 | 94.59,77.06 | 94.59,77.06 94.65,77 94.65,82.49 J10.3
  Bottom 0.813: IC1.25 SW1.7
SW4
  Bottom 0.254: SW1.8 R11.2 61.3,71.79
  Bottom 0.406: 61.3,71.79 61.3,67.1 61.41,66.98 61.41,66.31 62.21,65.51 70.02,65.51 71.56,63.98 71.56,63.51 71.89,63.18 91.52,63.18 93.58,65.25 93.58,75.39 92.05,76.93 92.05,82.42 J10.4
  Bottom 0.813: IC1.24 SW1.8
VIN
  Bottom 0.61: IC3.1 2.59,33.22 5.42,30.39
  Bottom 0.813: B1.+ 5.42,28.61 5.42,30.39 5.42,31.15 9.17,31.15 | IC2.1 9.17,31.15 | C3.1 9.17,31.94 9.17,31.15
(copper drawn outside any net)
  shapes: Top area x2

### Text on the board
Bottom: please print 6 nos | INCUBATOR CONTROLLER | TOMSON ELECTRONICS